# Altium schematic sheet Option_key.SchDoc
size 297 x 209 mm
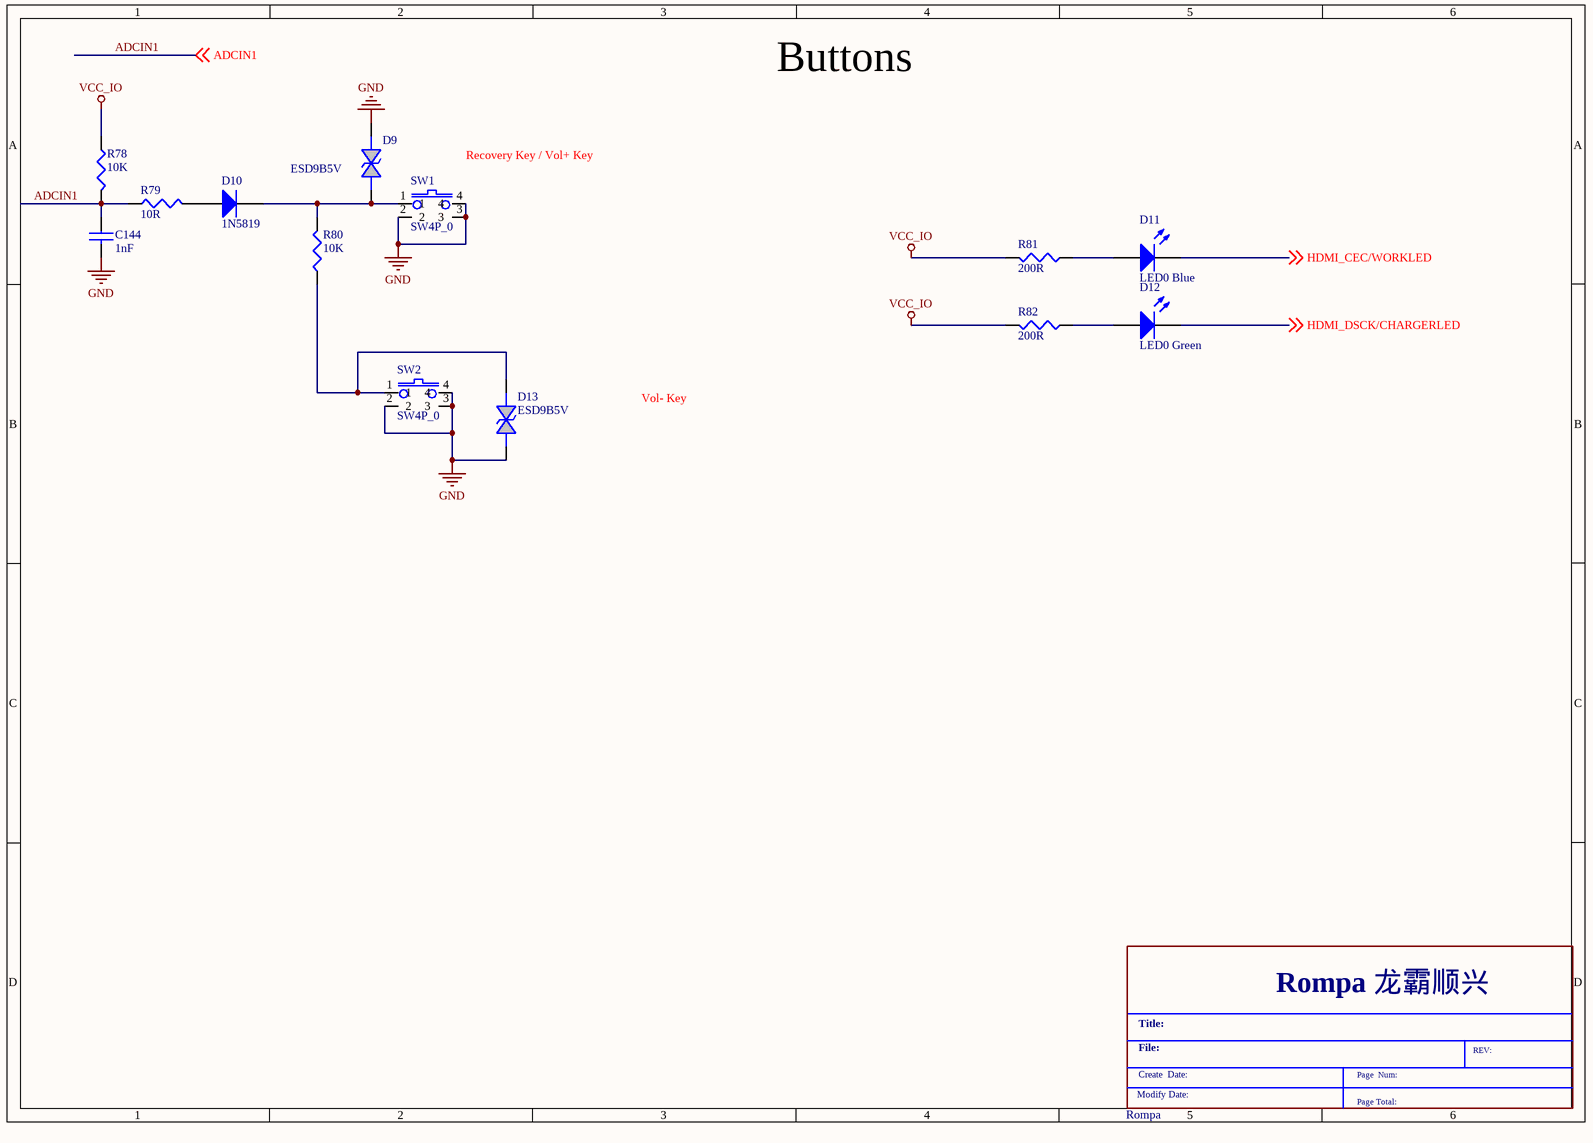
[diagram p0: Option_key.SchDoc]

## Parts
*  Rompa  (graphical)
C144  1nF  [C0402]
D9  ESD9B5V
D10  1N5819
D11  LED0 Blue  [1608[0603]]
D12  LED0 Green  [1608[0603]]
D13  ESD9B5V
R78  10K  [R0402]
R79  10R  [R0402]
R80  10K  [R0402]
R81  200R  [R0402]
R82  200R  [R0402]
SW1  SW4P_0
SW2  SW4P_0

## Nets
GND: C144.2 D9.2 D13.2 SW1.2 SW1.3 SW1.4 SW2.2 SW2.3 SW2.4
VCC_IO: R78.1 R81.2 R82.2
ADCIN1: C144.1 R78.2 R79.1 ; off-sheet ADCIN1
HDMI_CEC/WORKLED: D11.2(K) ; off-sheet HDMI_CEC/WORKLED
HDMI_DSCK/CHARGERLED: D12.2(K) ; off-sheet HDMI_DSCK/CHARGERLED
NetD9_1: D9.1 D10.2(K) R80.2 SW1.1
NetD10_1: D10.1(A) R79.2
NetD11_1: D11.1(A) R81.1
NetD12_1: D12.1(A) R82.1
NetD13_1: D13.1 R80.1 SW2.1

## Notes on the sheet
- Buttons
- (near SW1) Recovery Key / Vol+ Key
- Vol- Key
- (in symbol Rompa) Rompa 龙霸顺兴; Title:; File:; REV:; Create  Date:; Page  Num:; Modify Date:; Page Total:

## Library data of the parts
C144 = CAP NP: 16V
D9 D13 = DIODE BI-DIR TRIG: FP:E0402N
D10 = Diode: Published: 8-Jun-2000; LatestRevisionDate: 17-Jul-2002; LatestRevisionNote: Re-released for DXP Platform.; PackageDocument: Sep-1996; PackageReference: SMC; Publisher: Altium Limited; Code_JEDEC: DO-214-AB
D11 D12 = LED0: Typical INFRARED GaAs LED   Blue; Published: 8-Jun-2000; LatestRevisionDate: 08-Jul-2005; LatestRevisionNote: Mech Layer 1 removed.; PackageReference: LED-0; Publisher: Altium Limited
R78 = RESISTOR: %1
R79-R82 = RESISTOR